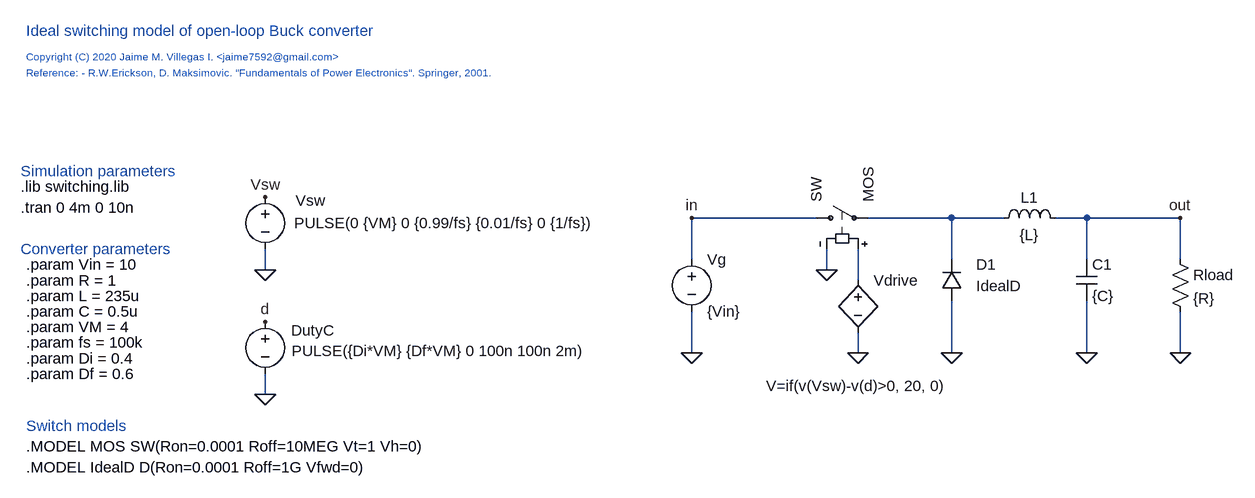
[diagram p0: schematic Buck_Ideal_OL_sw.asc]
Buck_Ideal_OL_sw.asc, the LTspice schematic file:
Version 4
SHEET 1 1756 992
WIRE 784 464 592 464
WIRE 992 464 864 464
WIRE 1072 464 992 464
WIRE 1200 464 1152 464
WIRE 1344 464 1200 464
WIRE 592 528 592 464
WIRE 992 528 992 464
WIRE 1200 528 1200 464
WIRE 1344 528 1344 464
WIRE -64 544 -64 512
WIRE 800 544 800 512
WIRE 848 560 848 512
WIRE 592 672 592 608
WIRE 848 672 848 640
WIRE 992 672 992 592
WIRE 1200 672 1200 592
WIRE 1344 672 1344 608
WIRE -64 736 -64 704
FLAG 1200 672 0
FLAG 1344 672 0
FLAG 592 672 0
FLAG 592 464 in
FLAG 1344 464 out
FLAG 992 672 0
FLAG -64 544 0
FLAG 800 544 0
FLAG -64 736 0
FLAG -64 624 d
FLAG -64 432 Vsw
FLAG 848 672 0
SYMBOL ind 1056 480 R270
WINDOW 0 32 56 VTop 2
WINDOW 3 5 56 VBottom 2
SYMATTR InstName L1
SYMATTR Value {L}
SYMBOL cap 1184 528 R0
SYMATTR InstName C1
SYMATTR Value {C}
SYMBOL res 1328 512 R0
SYMATTR InstName Rload
SYMATTR Value {R}
SYMBOL voltage 592 512 R0
SYMATTR InstName Vg
SYMATTR Value {Vin}
SYMBOL voltage -64 416 R0
WINDOW 0 47 21 Left 2
WINDOW 3 45 56 Left 2
WINDOW 123 0 0 Left 0
WINDOW 39 0 0 Left 0
SYMATTR InstName Vsw
SYMATTR Value PULSE(0 {VM} 0 {0.99/fs} {0.01/fs} 0 {1/fs})
SYMBOL sw 768 464 R270
SYMATTR InstName SW
SYMATTR Value MOS
SYMBOL diode 1008 592 R180
WINDOW 0 -53 56 Left 2
WINDOW 3 -92 23 Left 2
SYMATTR InstName D1
SYMATTR Value IdealD
SYMBOL voltage -64 608 R0
WINDOW 3 41 61 Left 2
WINDOW 123 0 0 Left 0
WINDOW 39 0 0 Left 0
WINDOW 0 40 29 Left 2
SYMATTR Value PULSE({Di*VM} {Df*VM} 0 100n 100n 2m)
SYMATTR InstName DutyC
SYMBOL bv 848 544 R0
WINDOW 3 -141 179 Left 2
SYMATTR Value V=if(v(Vsw)-v(d)>0, 20, 0)
SYMATTR InstName Vdrive
TEXT -432 536 Left 2 !.param Vin = 10
TEXT -432 584 Left 2 !.param L = 235u
TEXT -440 448 Left 2 !.tran 0 4m 0 10n
TEXT -440 416 Left 2 !.lib switching.lib
TEXT -432 608 Left 2 !.param C = 0.5u
TEXT -432 560 Left 2 !.param R = 1
TEXT -440 512 Left 2 ;Converter parameters
TEXT -440 392 Left 2 ;Simulation parameters
TEXT -432 176 Left 2 ;Ideal switching model of open-loop Buck converter
TEXT -432 240 Left 1 ;Reference: - R.W.Erickson, D. Maksimovic. "Fundamentals of Power Electronics". Springer, 2001.
TEXT -432 216 Left 1 ;Copyright (C) 2020 Jaime M. Villegas I. <jaime7592@gmail.com>
TEXT -432 848 Left 2 !.MODEL IdealD D(Ron=0.0001 Roff=1G Vfwd=0)
TEXT -432 816 Left 2 !.MODEL MOS SW(Ron=0.0001 Roff=10MEG Vt=1 Vh=0)
TEXT -432 632 Left 2 !.param VM = 4
TEXT -432 656 Left 2 !.param fs = 100k
TEXT -432 784 Left 2 ;Switch models
TEXT -432 680 Left 2 !.param Di = 0.4
TEXT -432 704 Left 2 !.param Df = 0.6

The netlist it stands for:
* Buck_Ideal_OL_sw.asc
L1 N001 out {L}
C1 out 0 {C}
Rload out 0 {R}
Vg in 0 {Vin}
Vsw Vsw 0 PULSE(0 {VM} 0 {0.99/fs} {0.01/fs} 0 {1/fs})
SW in N001 N002 0 MOS
D1 0 N001 IdealD
V§DutyC d 0 PULSE({Di*VM} {Df*VM} 0 100n 100n 2m)
B§Vdrive N002 0 V=if(v(Vsw)-v(d)>0, 20, 0)
.model D D
.lib standard.dio
.param Vin = 10
.param L = 235u
.tran 0 4m 0 10n
.lib switching.lib
.param C = 0.5u
.param R = 1
* Converter parameters
* Simulation parameters
* Ideal switching model of open-loop Buck converter
* Reference: - R.W.Erickson, D. Maksimovic. "Fundamentals of Power Electronics". Springer, 2001.
* Copyright (C) 2020 Jaime M. Villegas I. <jaime7592@gmail.com>
.MODEL IdealD D(Ron=0.0001 Roff=1G Vfwd=0)
.MODEL MOS SW(Ron=0.0001 Roff=10MEG Vt=1 Vh=0)
.param VM = 4
.param fs = 100k
* Switch models
.param Di = 0.4
.param Df = 0.6
.backanno
.end